# Altium schematic sheet Module.SchDoc
size A4
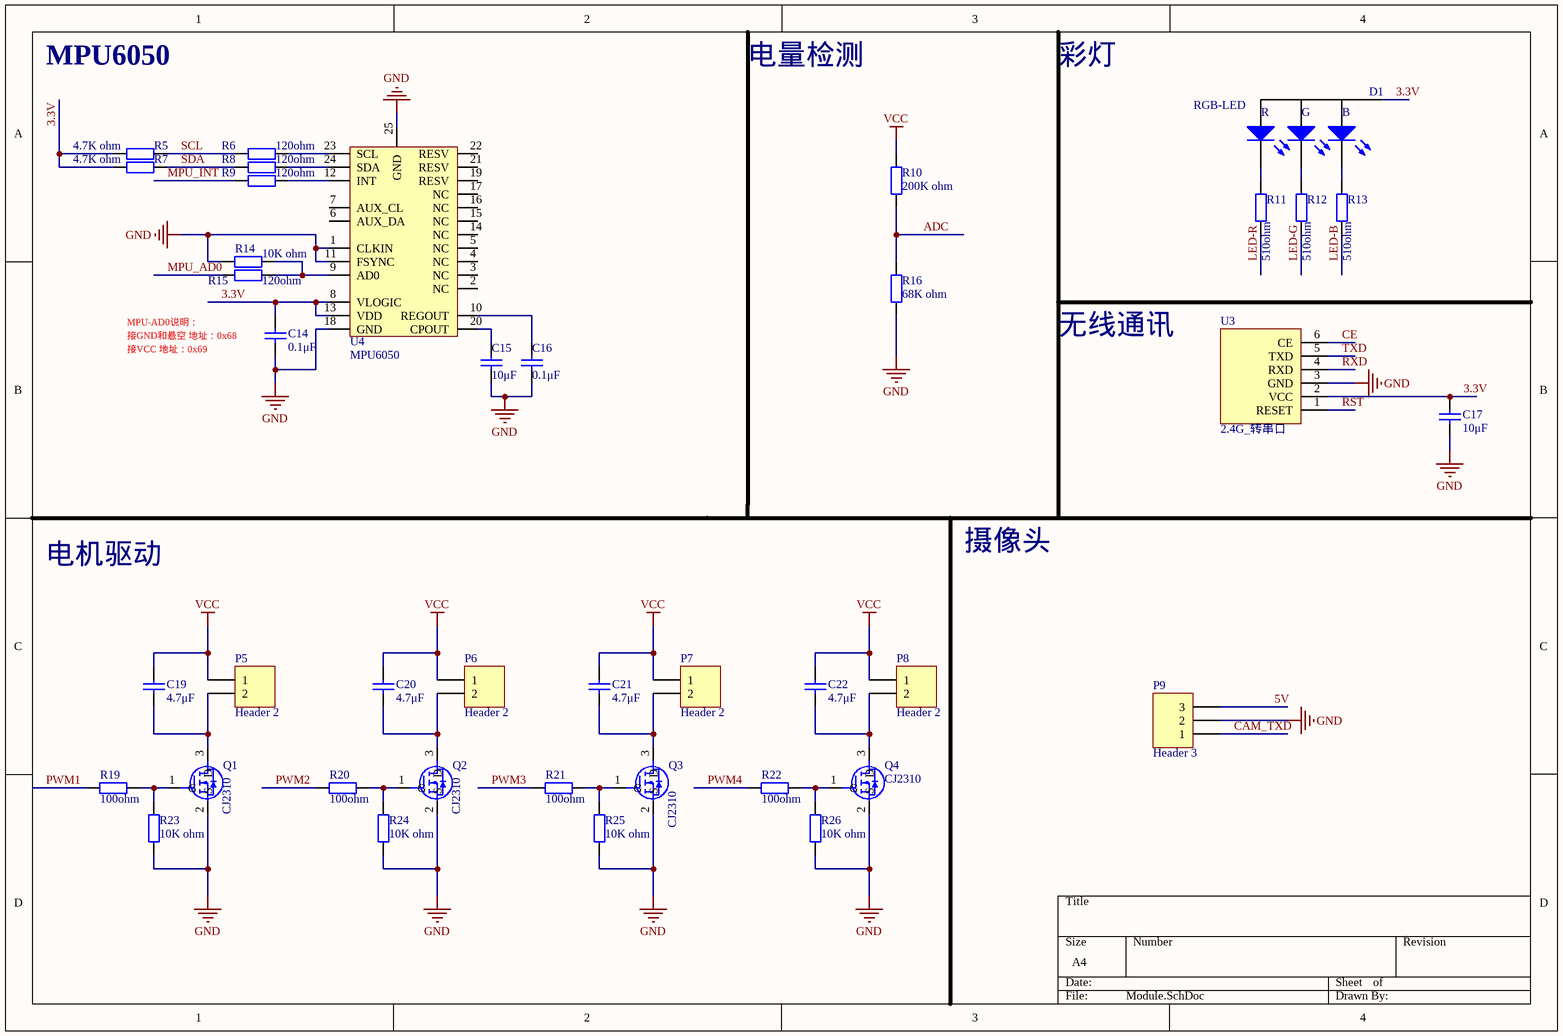
[diagram p0: Module.SchDoc]

## Parts
C14  0.1μF  [0603C]
C15  10μF  [0603C]
C16  0.1μF  [0603C]
C17  10μF  [0603C]
C19  4.7μF  [0603C]
C20  4.7μF  [0603C]
C21  4.7μF  [0603C]
C22  4.7μF  [0603C]
D1  RGB-LED  [RGB-LED]
P5  Header 2  [HDR1X2]
P6  Header 2  [HDR1X2]
P7  Header 2  [HDR1X2]
P8  Header 2  [HDR1X2]
P9  Header 3  [HDR1X3]
Q1  CJ2310  [SOT23-3]
Q2  CJ2310  [SOT23-3]
Q3  CJ2310  [SOT23-3]
Q4  CJ2310  [SOT23-3]
R5  4.7K ohm  [0603R]
R6  120ohm  [0603R]
R7  4.7K ohm  [0603R]
R8  120ohm  [0603R]
R9  120ohm  [0603R]
R10  200K ohm  [0603R]
R11  510ohm  [0603R]
R12  510ohm  [0603R]
R13  510ohm  [0603R]
R14  10K ohm  [0603R]
R15  120ohm  [0603R]
R16  68K ohm  [0603R]
R19  100ohm  [0603R]
R20  100ohm  [0603R]
R21  100ohm  [0603R]
R22  100ohm  [0603R]
R23  10K ohm  [0603R]
R24  10K ohm  [0603R]
R25  10K ohm  [0603R]
R26  10K ohm  [0603R]
U3  2.4G_转串口  [2.4G-串口]
U4  MPU6050  [QFN24]

## Nets
GND: C14.1 C15.1 C16.1 C17.1 P9.2 Q1.2(S) Q2.2(S) Q3.2(S) Q4.2(S) R14.1 R16.1 R23.1 R24.1 R25.1 R26.1 U3.3(GND) U4.1(CLKIN) U4.11(FSYNC) U4.18(GND) U4.25(GND)
VCC: C19.2 C20.2 C21.2 C22.2 P5.1 P6.1 P7.1 P8.1 R10.2
3.3V: C14.2 C17.2 D1.3 R5.1 R7.1 U3.2(VCC) U4.8(VLOGIC) U4.13(VDD)
5V: P9.3
ADC: R10.1 R16.2
CAM_TXD: P9.1
CE: U3.6(CE)
LED-B: R13.1
LED-G: R12.1
LED-R: R11.1
MPU_AD0: R15.1
MPU_INT: R9.1
PWM1: R19.1
PWM2: R20.1
PWM3: R21.1
PWM4: R22.1
RST: U3.1(RESET)
RXD: U3.4(RXD)
SCL: R5.2 R6.1
SDA: R7.2 R8.1
TXD: U3.5(TXD)
NetC15_2: C15.2 U4.20(CPOUT)
NetC16_2: C16.2 U4.10(REGOUT)
NetC19_1: C19.1 P5.2 Q1.3(D)
NetC20_1: C20.1 P6.2 Q2.3(D)
NetC21_1: C21.1 P7.2 Q3.3(D)
NetC22_1: C22.1 P8.2 Q4.3(D)
NetD1_1: D1.1 R13.2
NetD1_2: D1.2 R12.2
NetD1_4: D1.4 R11.2
NetQ1_1: Q1.1(G) R19.2 R23.2
NetQ2_1: Q2.1(G) R20.2 R24.2
NetQ3_1: Q3.1(G) R21.2 R25.2
NetQ4_1: Q4.1(G) R22.2 R26.2
NetR6_2: R6.2 U4.23(SCL)
NetR8_2: R8.2 U4.24(SDA)
NetR9_2: R9.2 U4.12(INT)
NetR14_2: R14.2 R15.2 U4.9(AD0)

Not connected (* = marked no-connect by the designer): U4 2(NC) 3(NC) 4(NC) 5(NC) 6(AUX_DA) 7(AUX_CL) 14(NC) 15(NC) 16(NC) 17(NC) 19(RESV) 21(RESV) 22(RESV)

## Notes on the sheet
- MPU6050
- 电量检测
- 彩灯
- MPU-AD0说明：
- 接GND和悬空 地址：0x68
- 接VCC 地址：0x69
- 无线通讯
- 电机驱动
- 摄像头
- (in symbol RGB-LED) R; G; B

## Library data of the parts
C14 C16 = Cap_0.1μF_50V_0603: 0.1μF_50V,X7R,±5%; 物料名称: 贴片陶瓷电容; 制造商: muRata; 物料编码: TCC0087; 物料型号: GRM188R71H104JA93D; 单位: PCS; 物料规格: 0.1μF_50V,X7R,±5%
C15 C17 = Cap_10μF_35V_0603: 10μF_35V,X5R,20%; 物料规格: 10μF_35V,20%; 物料名称: 贴片陶瓷电容; 制造商: muRata; 物料编码: TCC0071; 物料型号: GRM188R6YA106MA73D; 单位: PCS
C19-C22 = Cap_4.7μF_50V_0603: 4.7μF_50V,±10%; 物料名称: 贴片陶瓷电容; 制造商: TDK; 物料编码: NA; 单位: PCS; 物料规格: 4.7μF_50V,±10%; 物料型号: NA
D1 = RGB-LED: 制造商: 亿光; 物料编码: NA; 物料型号: TLMB1100; 单位: PCS; 物料规格: RGB-LED; 物料名称: RGB-LED
P5-P8 = Header 2: Header, 2-Pin; LatestRevisionDate: 17-Jul-2002; LatestRevisionNote: Re-released for DXP Platform.; Publisher: Altium Limited
P9 = Header 3: Header, 3-Pin; LatestRevisionDate: 17-Jul-2002; LatestRevisionNote: Re-released for DXP Platform.; Publisher: Altium Limited
Q1-Q4 = CJ2310: 物料名称: NMOS; 制造商: JSCJ; 物料编码: NA; 单位: PCS; 物料规格: CJ2310; 物料型号: CJ2310
R5 R7 = Res_4.7K ohm_0603: 4.7K ohm,1%; 物料名称: 贴片电阻; 制造商: YAGEO; 物料型号: AA0603FR-074K7L; 单位: PCS; 物料规格: 4.7K ohm,1%
R6 R8 R9 R15 = Res_120ohm_0603: 120 ohm_5%; 物料名称: 贴片电阻; 制造商: YAGEO; 物料编码: NA; 单位: PCS; 物料规格: 120 ohm_5%; 物料型号: NA
R10 = Res_200K ohm_0603: 200K ohm,1%; 物料名称: 贴片电阻; 制造商: YAGEO; 物料编码: TRS0060; 物料型号: RC0603FR-07200KL; 单位: PCS; 物料规格: 200K ohm,1%
R11-R13 = Res_510ohm_0603: 510 ohm,1%; 物料名称: 贴片电阻; 制造商: YAGEO; 单位: PCS; 物料规格: 510 ohm,1%
R14 R23-R26 = Res_10K ohm_0603: 10K ohm,1%; 物料名称: 贴片电阻; 制造商: YAGEO; 物料编码: TRS0020; 物料型号: RC0603FR-0710KL; 单位: PCS; 物料规格: 10K ohm,1%
R16 = Res_68K ohm_0603: 68K ohm,1%; 物料名称: 贴片电阻; 制造商: YAGEO; 物料编码: NA; 物料型号: RC0603FR-0768KL; 单位: PCS; 物料规格: 68K ohm,1%
R19-R22 = Res_100ohm_0603: 100 ohm_5%; 物料名称: 贴片电阻; 制造商: YAGEO; 物料编码: TRS0010; 物料型号: RC0603JR-07100R; 单位: PCS; 物料规格: 100 ohm_5%
U3 = 2.4G_转串口: 制造商: NA; 单位: PCS; 物料规格: 2.4G_转串口; 物料名称: 2.4G_转串口; 物料编码: NA; 物料型号: 2.4G_转串口
U4 = MPU6050: 物料名称: 陀螺仪; 制造商: InvenSense; 物料编码: NA; 单位: PCS; 物料规格: MPU6050; 物料型号: MPU6050